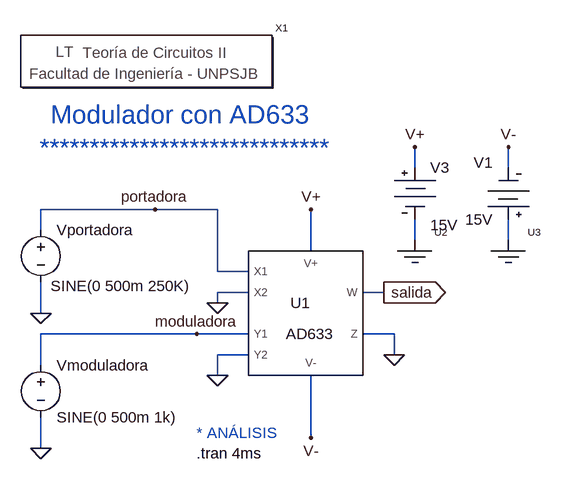
[diagram p0: schematic Modulador con AD633.asc]
Modulador con AD633.asc, the LTspice schematic file:
Version 4
SHEET 1 1076 680
WIRE 528 -64 528 -96
WIRE 672 -64 672 -96
WIRE 128 0 -48 0
WIRE 224 0 128 0
WIRE -48 32 -48 0
WIRE 528 48 528 16
WIRE 672 48 672 16
WIRE 368 64 368 0
WIRE 224 96 224 0
WIRE 272 96 224 96
WIRE 272 128 224 128
WIRE 480 128 448 128
WIRE 224 144 224 128
WIRE -48 160 -48 112
WIRE 192 192 -48 192
WIRE 272 192 192 192
WIRE 496 192 448 192
WIRE 272 224 224 224
WIRE 496 224 496 192
WIRE -48 240 -48 192
WIRE 224 256 224 224
WIRE 368 352 368 256
WIRE -48 368 -48 320
FLAG 528 -96 V+
FLAG 672 -96 V-
FLAG -48 368 0
FLAG 224 144 0
FLAG -48 160 0
FLAG 128 0 portadora
FLAG 192 192 moduladora
FLAG 224 256 0
FLAG 480 128 salida
IOPIN 480 128 Out
FLAG 496 224 0
FLAG 368 0 V+
FLAG 368 352 V-
SYMBOL voltage -48 16 R0
WINDOW 3 15 102 Left 2
SYMATTR Value SINE(0 500m 250K)
SYMATTR InstName Vportadora
SYMBOL voltage -48 224 R0
SYMATTR InstName Vmoduladora
SYMATTR Value SINE(0 500m 1k)
SYMBOL ad633 368 160 R0
SYMATTR InstName U1
SYMBOL bateria 528 -80 R0
SYMATTR InstName V3
SYMATTR Value 15V
SYMBOL bateria 672 32 R180
WINDOW 0 24 104 Left 2
WINDOW 3 24 16 Left 2
SYMATTR InstName V1
SYMATTR Value 15V
SYMBOL Circuitos2\\Letreros\\Teoría\ de\ Circuitos\ II 112 -224 R0
SYMATTR InstName X1
SYMBOL Circuitos2\\Llaves\\masa 528 64 R0
SYMATTR InstName U2
SYMBOL Circuitos2\\Llaves\\masa 672 64 R0
SYMATTR InstName U3
TEXT 192 376 Left 2 !.tran 4ms
TEXT 168 -120 Center 4 ;Modulador con AD633\n*****************************
TEXT 192 344 Left 2 ;* ANÁLISIS

The netlist it stands for:
* Modulador con AD633.asc
Vportadora portadora 0 SINE(0 500m 250K)
Vmoduladora moduladora 0 SINE(0 500m 1k)
XU1 portadora 0 moduladora 0 V- 0 salida V+ AD633  ; pins X1 X2 Y1 Y2 V- Z W V+
V3 V+ N001 15V
V1 N002 V- 15V
XX1 Teoría de Circuitos II
XU2 N001 masa masa  ; pins 1
XU3 N002 masa masa  ; pins 1
.tran 4ms
* Modulador con AD633
* *****************************
* * ANÁLISIS
.lib ..\sym\Circuitos2\Multiplicador\ad633.lib
.lib ..\sym\Circuitos2\Fuentes\Fuentes.lib
.backanno
.end